# Altium schematic sheet 3.3V_5V_LogicLevelConverter.SchDoc
size Letter
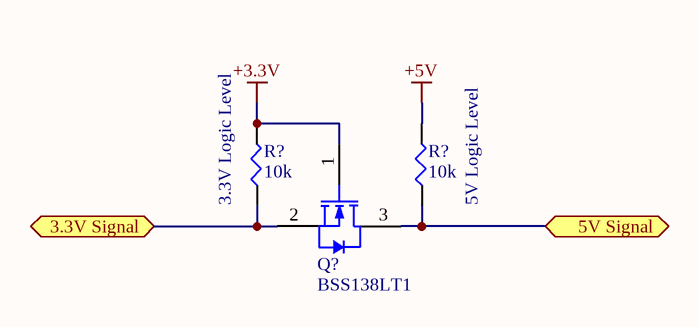
[diagram p0: 3.3V_5V_LogicLevelConverter.SchDoc]

## Parts
(Parts that share a designator on the sheet are numbered #1, #2 ... from top to bottom, then left to right.)
Q?  BSS138LT1  [ONSC-SOT-23-3-318-08_V]
R?#1  10k  [SMD-0603-RES]
R?#2  10k  [SMD-0603-RES]

## Ports
3.3V Signal (bidir), 5V Signal (bidir)

## Nets
+3.3V: Q?.1(G) R?#1.2
+5V: R?#2.2
3.3V Signal: Q?.2(S) R?#1.1 ; port 3.3V Signal
5V Signal: Q?.3(D) R?#2.1 ; port 5V Signal

## Notes on the sheet
- (near R?#1) 3.3V Logic Level
- (near R?#2) 5V Logic Level

## Library data of the parts
Q? = BSS138LT1: Power MOSFET, 200 mA, 50 V, N-Channel, 3-Pin SOT-23, Tape and Reel; Manufacturer: On Semiconductor; Channel Polarity: N Channel; Ciss Typ (pF): 40; Configuration: Single; Coss Typ (pF): 12; Crss Typ (pF): 3.5; ID Max (A): 0.2; PD Max (W): 0.225; V(BR)DSS Min (V): 50; VGS Max (V): 20; VGS(th) Max (V): 1.5; DatasheetVersion: Rev. 8; PackageVersion: Rev. AP, 11/2009; PackageReference: SOT-23-3-318-08; PackageDescription: 3-Pin Small Outline Transistor, Body 2.92 x 1.3 mm, Pitch 0.95 mm; Supplier 1: Digi-Key; Supplier Part Number 1: BSS138LT1OSCT-ND; Package Type: SOT-23-3; Packing: Tape and Reel; Mounting Technology: Surface Mount; PartNumber: BSS138LT1; ComponentLink1Description: Manufacturer URL; ComponentLink1URL: http://www.onsemi.com/; ComponentLink2Description: Datasheet; ComponentLink2URL: http://www.onsemi.com/pub_link/Collateral/BSS138LT1-D.PDF; ComponentLink3Description: Package Specification; ComponentLink3URL: http://www.onsemi.cn/pub_link/Collateral/318-08.PDF
R?#1 R?#2 = ERJ-3GEYJ103V: RES SMD 10K OHM 5% 1/10W 0603; Manufacturer: Panasonic Electronic Components; Factory Stock: 0; Unit Price (USD): 0.00321; @ qty: 1500; Minimum Quantity: 1; Power (Watts): 0.1W, 1/10W; Temperature Coefficient: ±200ppm/°C; Part Number: ERJ-3GEYJ103V; Datasheets: http://industrial.panasonic.com/www-cgi/jvcr13pz.cgi?E+PZ+3+AOA0001+ERJ3GEYJ103V+7+WW; Image: //media.digikey.com/Photos/Panasonic%20Photos/MFG_ERJ-P6W%20Series.jpg; Digi-Key Part Number: P10KGCT-ND; Quantity Available: 7178118; Packaging: Cut Tape (CT); Series: ERJ; Part Status: Active; Value: 10k; Tolerance: ±5%; Composition: Thick Film; Features: Automotive AEC-Q200; Operating Temperature: -55°C ~ 155°C; Package / Case: 0603 (1608 Metric); Supplier Device Package: 0603; Size / Dimension: 0.063" L x 0.031" W (1.60mm x 0.80mm); Height - Seated (Max): 0.022" (0.55mm); Number of Terminations: 2; Failure Rate: -